# Altium schematic sheet TWindow.SchDoc: LiveDesign Evaluation - Countdown
size A4; Organization: Altium Limited; Address1: L3, 12a Rodborough Rd; Address2: Frenchs Forest; Address3: NSW; Address4: Australia 2086; DocumentNumber: 11; SheetNumber: 11; SheetTotal: 11
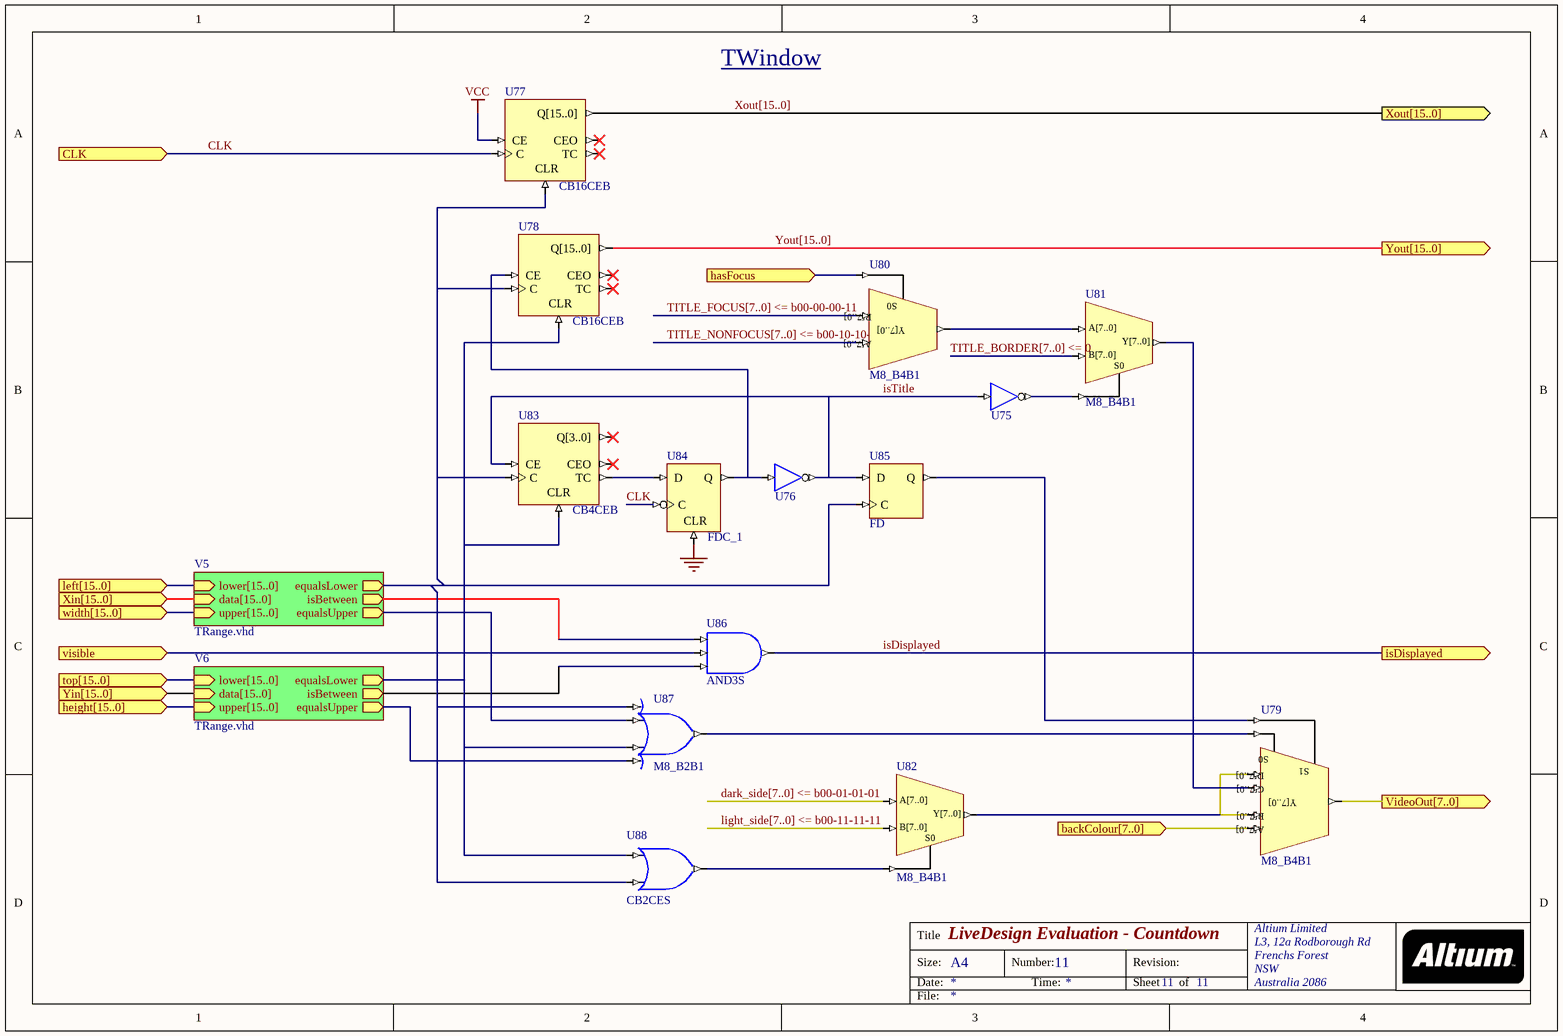
[diagram p0: TWindow.SchDoc]

## Parts
U75  INV  (value not drawn)
U76  INV  (value not drawn)
U77  CB16CEB
U78  CB16CEB
U79  M8_B4B1
U80  M8_B4B1
U81  M8_B4B1
U82  M8_B4B1
U83  CB4CEB
U84  FDC_1
U85  FD
U86  AND3S
U87  M8_B2B1
U88  CB2CES

## Sub-sheets
V5 = TRange.vhd: lower[15..0] (in), data[15..0] (in), upper[15..0] (in), isBetween (out), equalsLower (out), equalsUpper (out)
V6 = TRange.vhd: lower[15..0] (in), data[15..0] (in), upper[15..0] (in), isBetween (out), equalsLower (out), equalsUpper (out)

## Ports
backColour[7..0] (in), CLK (in), hasFocus (in), height[15..0] (in), isDisplayed (out), left[15..0] (in), top[15..0] (in), VideoOut[7..0] (out), visible (in), width[15..0] (in), Xin[15..0] (in), Xout[15..0] (out), Yin[15..0] (in), Yout[15..0] (out)

## Nets
GND: U84.CLR
VCC: U77.CE
backColour[7..0]: U79.A[7..0] ; port backColour[7..0]
CLK: U77.C U84.C ; port CLK
dark_side[7..0] <= b00-01-01-01: U82.A[7..0]
hasFocus: U80.S0 ; port hasFocus
isDisplayed: U86.O ; port isDisplayed
isTitle: U75.I U76.O U83.CE U85.D
light_side[7..0] <= b00-11-11-11: U82.B[7..0]
TITLE_BORDER[7..0] <= 0: U81.B[7..0]
TITLE_FOCUS[7..0] <= b00-00-00-11: U80.B[7..0]
TITLE_NONFOCUS[7..0] <= b00-10-10-10: U80.A[7..0]
VideoOut[7..0]: U79.Y[7..0] ; port VideoOut[7..0]
visible: U86.I1 ; port visible
Xout[15..0]: U77.Q[15..0] ; port Xout[15..0]
Yout[15..0]: U78.Q[15..0] ; port Yout[15..0]
NetU75_O: U75.O U81.S0
NetU76_I: U76.I U78.CE U84.Q
NetU77_CLR: U77.CLR U78.C U83.C U85.C U87.I0 U88.I1 ; sheet V5/equalsLower
NetU78_CLR: U78.CLR U83.CLR U87.I2 U88.I0 ; sheet V6/equalsLower
NetU79_B[7..0]: U79.B[7..0] U79.D[7..0] U82.Y[7..0]
NetU79_C[7..0]: U79.C[7..0] U81.Y[7..0]
NetU79_S0: U79.S0 U87.O
NetU79_S1: U79.S1 U85.Q
NetU80_Y[7..0]: U80.Y[7..0] U81.A[7..0]
NetU82_S0: U82.S0 U88.O
NetU83_TC: U83.TC U84.D
NetU86_I0: U86.I0 ; sheet V5/isBetween
NetU86_I2: U86.I2 ; sheet V6/isBetween
NetU87_I1: U87.I1 ; sheet V5/equalsUpper
NetU87_I3: U87.I3 ; sheet V6/equalsUpper

Not connected (* = marked no-connect by the designer): U77 CEO* TC*; U78 CEO* TC*; U83 CEO* Q[3..0]*

## Buses and harness runs
bus dark_side[7..0] <= b00-01-01-01
bus light_side[7..0] <= b00-11-11-11
bus port height[15..0] = sheet V6/upper[15..0]
bus port left[15..0] = sheet V5/lower[15..0]
bus port top[15..0] = sheet V6/lower[15..0]
bus port width[15..0] = sheet V5/upper[15..0]
bus port Xin[15..0] = sheet V5/data[15..0]
bus port Yin[15..0] = sheet V6/data[15..0]
bus TITLE_BORDER[7..0] <= 0
bus TITLE_FOCUS[7..0] <= b00-00-00-11
bus TITLE_NONFOCUS[7..0] <= b00-10-10-10
bus Xout[15..0] = port Xout[15..0]
bus Yout[15..0] = port Yout[15..0]

## Notes on the sheet
- TWindow
- Title
- Size:
- Date:
- A4
- Number:
- Time:
- Revision:
- Sheet
- of
- File:

## Library data of the parts
U75 U76 = INV: Inverter; ArchiveName: GENERIC; VHDLIB_SIM: GENERIC_LIB; Published: 29-Jan-2004; Publisher: Altium Limited; Xilinx Equivalent: INV; Core Revision: 1.00.00
U77 U78 = CB16CEB: 16-Bit Cascadable Binary Counters with Clock Enable and Asynchronous Clear, Bus Version; Xilinx Equivalent: CB16CE; ArchiveName: GENERIC; VHDLIB_SIM: GENERIC_LIB; Published: 29-Jan-2004; Publisher: Altium Limited; Core Revision: 1.00.00
U79 = M8_B4B1: 4x8-Bit Bus to 1x8-Bit Bus Multiplexer; ArchiveName: GENERIC; VHDLIB_SIM: GENERIC_LIB; Published: 29-Jan-2004; Publisher: Altium Limited; Core Revision: 1.00.00
U80-U82 = M8_B2B1: 2x8-Bit Bus to 1x8-Bit Bus Multiplexer; ArchiveName: GENERIC; VHDLIB_SIM: GENERIC_LIB; Published: 29-Jan-2004; Publisher: Altium Limited; Core Revision: 1.00.00
U83 = CB4CEB: 4-Bit Cascadable Binary Counters with Clock Enable and Asynchronous Clear, Bus Version; ArchiveName: GENERIC; VHDLIB_SIM: GENERIC_LIB; Published: 29-Jan-2004; Publisher: Altium Limited; Core Revision: 1.00.00
U84 = FDC_1: D-Type Negative Edge Flip-Flop with Asynchronous Clear; ArchiveName: GENERIC; VHDLIB_SIM: GENERIC_LIB; Published: 29-Jan-2004; Publisher: Altium Limited; Xilinx Equivalent: FDC_1; Core Revision: 1.00.00
U85 = FD: D-Type Flip-Flop; ArchiveName: GENERIC; VHDLIB_SIM: GENERIC_LIB; Published: 29-Jan-2004; Publisher: Altium Limited; Xilinx Equivalent: FD; Core Revision: 1.00.00
U86 = AND3S: 3-Input AND Gate, Single Pin Version; Xilinx Equivalent: AND3; ArchiveName: GENERIC; VHDLIB_SIM: GENERIC_LIB; Published: 29-Jan-2004; Publisher: Altium Limited; Core Revision: 1.00.00
U87 = OR4S: 4-Input OR Gate, Single Pin Version; Xilinx Equivalent: OR4; ArchiveName: GENERIC; VHDLIB_SIM: GENERIC_LIB; Published: 29-Jan-2004; Publisher: Altium Limited; Core Revision: 1.00.00
U88 = OR2S: 2-Input OR Gate, Single Pin Version; Xilinx Equivalent: OR2; ArchiveName: GENERIC; VHDLIB_SIM: GENERIC_LIB; Published: 29-Jan-2004; Publisher: Altium Limited; Core Revision: 1.00.00